# Altium project RfLauchPadAdapter.PrjPcb
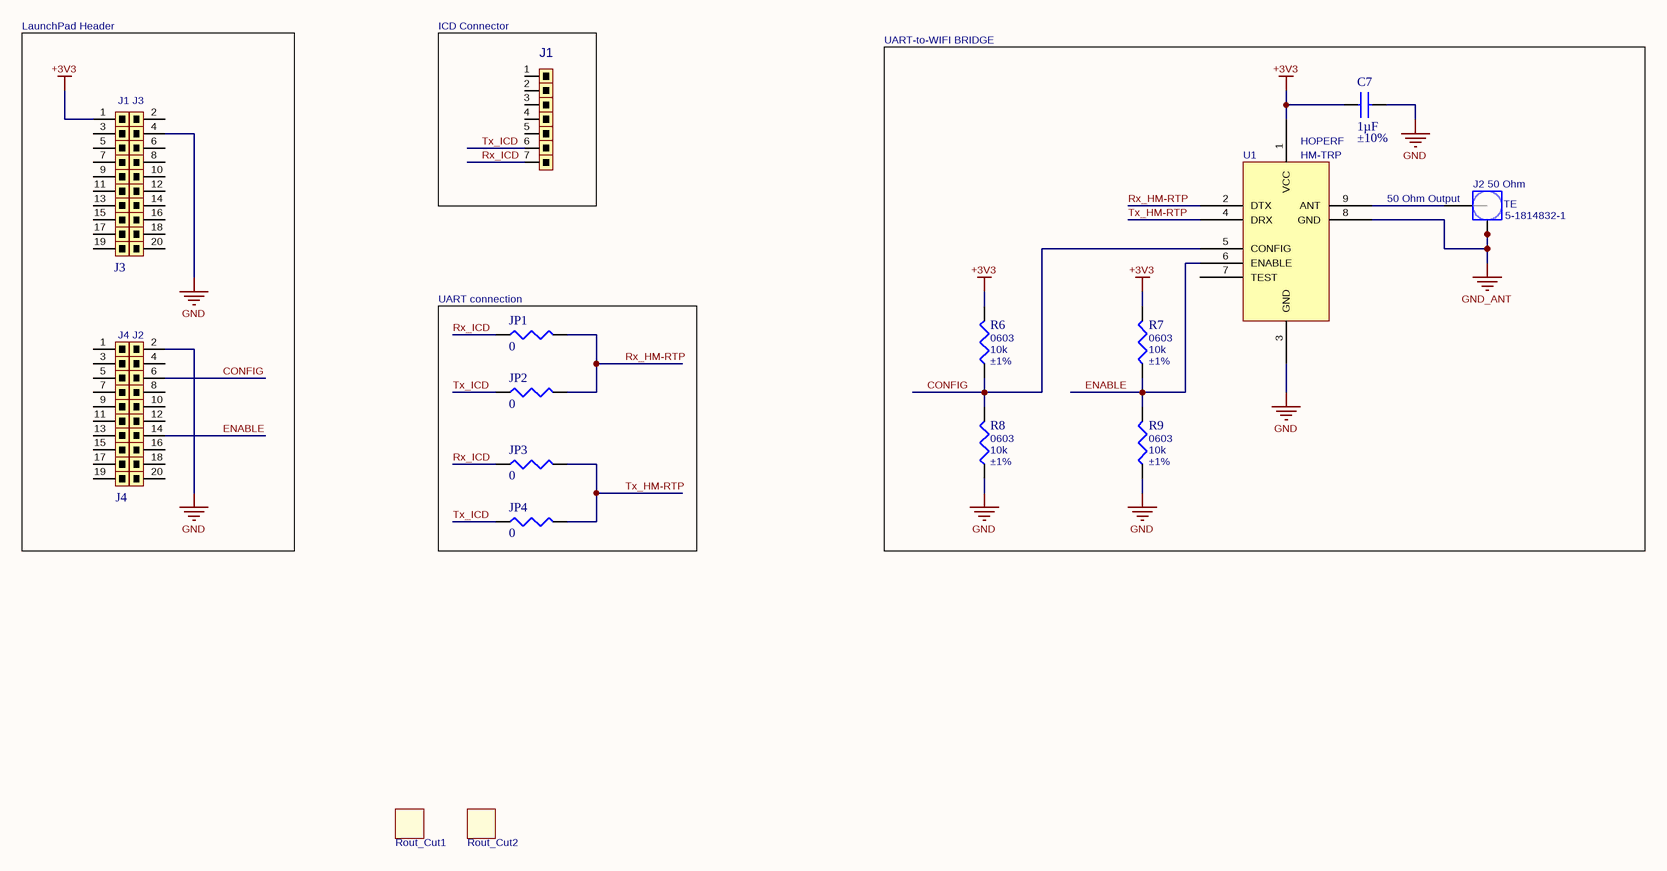
[diagram p0: RfLauchPadAdapter.SchDoc]
Classification: CONFIDENTIAL; DrwnBy: MB; DrwnDate: 23.08.2016; Project: PYCO; ProjectTitle: RF LaunchPad Adapter; REV: A; VER: 01
1 sheet, 16 parts. Net scope: global (net labels, ports and power ports of the same name join across sheets).
Board file: RfLaunchPadAdapter.PcbDoc

## Sheet RfLauchPadAdapter.SchDoc: RF LaunchPad Adapter
size A3; DocumentNumber: 2; Revision: 11; SheetNumber: 2; SheetTotal: 2

### Parts
C7  Capacitance: 1µF  Tolerance: ±10%  [C0603]  (hidden comment: GRM188R61C105KA93D)
J1  Header 1x7  [Post Height Terminal Strip 1x7]  (value not drawn)
J2  5-1814832-1  Impedance: 50 Ohm  Manufacturer: TE  [5-1814832-1]
J3  Header 2x10  [Post Height Terminal Strip 2x10]  (value not drawn)
J4  Header 2x10  [Post Height Terminal Strip 2x10]  (value not drawn)
JP1  Resistance (Ohms): 0  [R0603]  (hidden comment: ERJ-3GEY0R00V)
JP2  Resistance (Ohms): 0  [R0603]  (hidden comment: ERJ-3GEY0R00V)
JP3  Resistance (Ohms): 0  [R0603]  (hidden comment: ERJ-3GEY0R00V)
JP4  Resistance (Ohms): 0  [R0603]  (hidden comment: ERJ-3GEY0R00V)
R6  Supplier Device Package: 0603  Resistance (Ohms): 10k  Tolerance: ±1%  [R0603]  (hidden comment: ERJ-3EKF1002V)
R7  Supplier Device Package: 0603  Resistance (Ohms): 10k  Tolerance: ±1%  [R0603]  (hidden comment: ERJ-3EKF1002V)
R8  Supplier Device Package: 0603  Resistance (Ohms): 10k  Tolerance: ±1%  [R0603]  (hidden comment: ERJ-3EKF1002V)
R9  Supplier Device Package: 0603  Resistance (Ohms): 10k  Tolerance: ±1%  [R0603]  (hidden comment: ERJ-3EKF1002V)
Rout_Cut1  Rout_Cut  [RoutCut]  (value not drawn)
Rout_Cut2  Rout_Cut  [RoutCut]  (value not drawn)
U1  HM-TRP  Manufacturer: HOPERF  [HM-TRP]

### Blocks framed on the sheet
ICD Connector: J1
UART connection: JP1-JP4

### Nets
+3V3: C7.1 J3.1 R6.2 R7.2 U1.1(VCC)
GND: C7.2 J3.4 J4.2 R8.1 R9.1 U1.3(GND)
GND_ANT: J2.2 J2.3 J2.4 J2.5 U1.8(GND)
CONFIG: J4.6 R6.1 R8.2 U1.5(CONFIG)
ENABLE: J4.14 R7.1 R9.2 U1.6(ENABLE)
Rx_HM-RTP: JP1.2 JP2.2 U1.2(DTX)
Rx_ICD: J1.7 JP1.1 JP3.1
Tx_HM-RTP: JP3.2 JP4.2 U1.4(DRX)
Tx_ICD: J1.6 JP2.1 JP4.1
NetJ2_1: J2.1 U1.9(ANT)

Not connected (* = marked no-connect by the designer): J1 1 2 3 4 5; J3 2 3 5 6 7 8 9 10 11 12 13 14 15 16 17 18 19 20; J4 1 3 4 5 7 8 9 10 11 12 13 15 16 17 18 19 20; U1 7(TEST)

### Notes on the sheet
- LaunchPad Header
- UART-to-WIFI BRIDGE
- (near J3) J1
- (near J3) J3
- (near J2) 50 Ohm Output
- (near J4) J4
- (near J4) J2
- INFORMATION
- CLASSIFICATION
- PROJECT
- COMPONENT
- SEKAI Europe GmbH
- TITLE
- The information contained in this schematic is the property of SEKAI Europe. Any usage in part or as whole without the written permission of SEKAI Europe is strictly prohibited.
- DRAWN
- DATE
- APPROVED
- VER.#
- SCHEM.#
- REV
- SHEET
- A3
- Printed:

### Library data of the parts
C7 = GRM188R61C105KA93D: CAP CER 1UF 16V 10% X5R 0603; Manufacturer: Murata Electronics North America; Supplier 1: Digi-Key; Manufacturer Part Number: GRM188R61C105KA93D; RoHS: RoHS Compliant; Category: Capacitors; Stock 1: 349717; Pricing 1: 1=0.15, 10=0.064, 50=0.035, 100=0.0297, 250=0.0242, 500=0.0207, 1000=0.01612 (EUR); Packaging: Cut Tape (CT); Voltage - Rated: 16V; Temperature Coefficient: X5R; Mounting Type: Surface Mount, MLCC; Operating Temperature: -55°C ~ 85°C; Applications: General Purpose; Ratings: -; Package / Case: 0603 (1608 Metric); Size / Dimension: 0.063" L x 0.031" W (1.60mm x 0.80mm); Height - Seated (Max): -; Thickness (Max): 0.035" (0.90mm); Lead Spacing: -; Features: -; Lead Style: -; ComponentLink1URL: http://www.murata.com/~/media/webrenewal/support/library/catalog/products/capacitor/mlcc/c02e.ashx; ComponentLink1Description: http://www.murata.com/~/media/webrenewal/support/library/catalog/products/capacitor/mlcc/c02e.ashx; Supplier Part Number 1: 490-1536-1-ND
J2 = 5-1814832-1: CONN SMA JACK STR 50 OHM PCB; Connector Type: Jack, Female Socket; Contact Termination: Solder; Frequency - Max: 3GHz; Body Material: Zinc Alloy; Body Finish: Gold; Center Contact Material: Phosphor Bronze; Dielectric Material: Polytetrafluoroethylene (PTFE); Voltage Rating: 500V; Supplier 1: Digi-Key; Manufacturer Part Number: 5-1814832-1; RoHS: RoHS Compliant; Category: Connectors, Interconnects; Stock 1: 19841; Pricing 1: 1=1.75, 10=1.588, 25=1.4904, 50=1.4258, 100=1.361, 250=1.23132, 500=1.13412, 1000=1.05312 (EUR); Packaging: Bulk; Part Status: Active; Connector Style: SMA; Shield Termination: Solder; Mounting Type: Through Hole; Cable Group: -; Fastening Type: Threaded; Features: -; Housing Color: Gold; Ingress Protection: -; Center Contact Plating: Gold; Operating Temperature: -65°C ~ 165°C; ComponentLink1URL: http://www.te.com/commerce/DocumentDelivery/DDEController?Action=srchrtrv&DocNm=1814832&DocType=Customer+Drawing&DocLang=English; ComponentLink1Description: http://www.te.com/commerce/DocumentDelivery/DDEController?Action=srchrtrv&DocNm=1814832&DocType=Customer+Drawing&DocLang=English; Supplier Part Number 1: A97594-ND
JP1-JP4 = ERJ-3GEY0R00V: 0R JUMPER 1/10W; Manufacturer: Panasonic Electronic Components; Power (Watts): 0.1W, 1/10W; Supplier 1: Digi-Key; Manufacturer Part Number: ERJ-3GEY0R00V; RoHS: RoHS Compliant; Category: Resistors; Stock 1: 5305583; Pricing 1: 1=0.1, 50=0.0128, 100=0.0098, 250=0.00732, 500=0.0054, 1000=0.0036, 2500=0.00304 (EUR); Packaging: Cut Tape (CT); Composition: Thick Film; Features: Automotive AEC-Q200; Temperature Coefficient: -; Operating Temperature: -55°C ~ 155°C; Package / Case: 0603 (1608 Metric); Supplier Device Package: 0603; Size / Dimension: 0.063" L x 0.031" W (1.60mm x 0.80mm); Height: 0.022" (0.55mm); Number of Terminations: 2; ComponentLink1URL: http://industrial.panasonic.com/www-cgi/jvcr13pz.cgi?E+PZ+3+AOA0001+ERJ3GEY0R00V+7+WW; ComponentLink1Description: http://industrial.panasonic.com/www-cgi/jvcr13pz.cgi?E+PZ+3+AOA0001+ERJ3GEY0R00V+7+WW; Supplier Part Number 1: P0.0GCT-ND
R6-R9 = ERJ-3EKF1002V: 10K OHM 1% 1/10W 0603; Manufacturer: Panasonic Electronic Components; Power (Watts): 0.1W, 1/10W; Temperature Coefficient: ±100ppm/°C; Supplier 1: Digi-Key; Manufacturer Part Number: ERJ-3EKF1002V; RoHS: RoHS Compliant; Category: Resistors; Stock 1: 4844013; Pricing 1: 1=0.1, 50=0.0154, 100=0.0117, 250=0.00864, 500=0.00638, 1000=0.00426, 2500=0.0036 (EUR); Packaging: Cut Tape (CT); Composition: Thick Film; Features: Automotive AEC-Q200; Operating Temperature: -55°C ~ 155°C; Package / Case: 0603 (1608 Metric); Size / Dimension: 0.063" L x 0.031" W (1.60mm x 0.80mm); Height: 0.022" (0.55mm); Number of Terminations: 2; ComponentLink1URL: http://industrial.panasonic.com/www-cgi/jvcr13pz.cgi?E+PZ+3+AOA0002+ERJ3EKF1002V+7+WW; ComponentLink1Description: http://industrial.panasonic.com/www-cgi/jvcr13pz.cgi?E+PZ+3+AOA0002+ERJ3EKF1002V+7+WW; Supplier Part Number 1: P10.0KHCT-ND
Rout_Cut1 Rout_Cut2 = Rout_Cut: 1.6mm